# Altium schematic sheet 总图.SchDoc
size A3
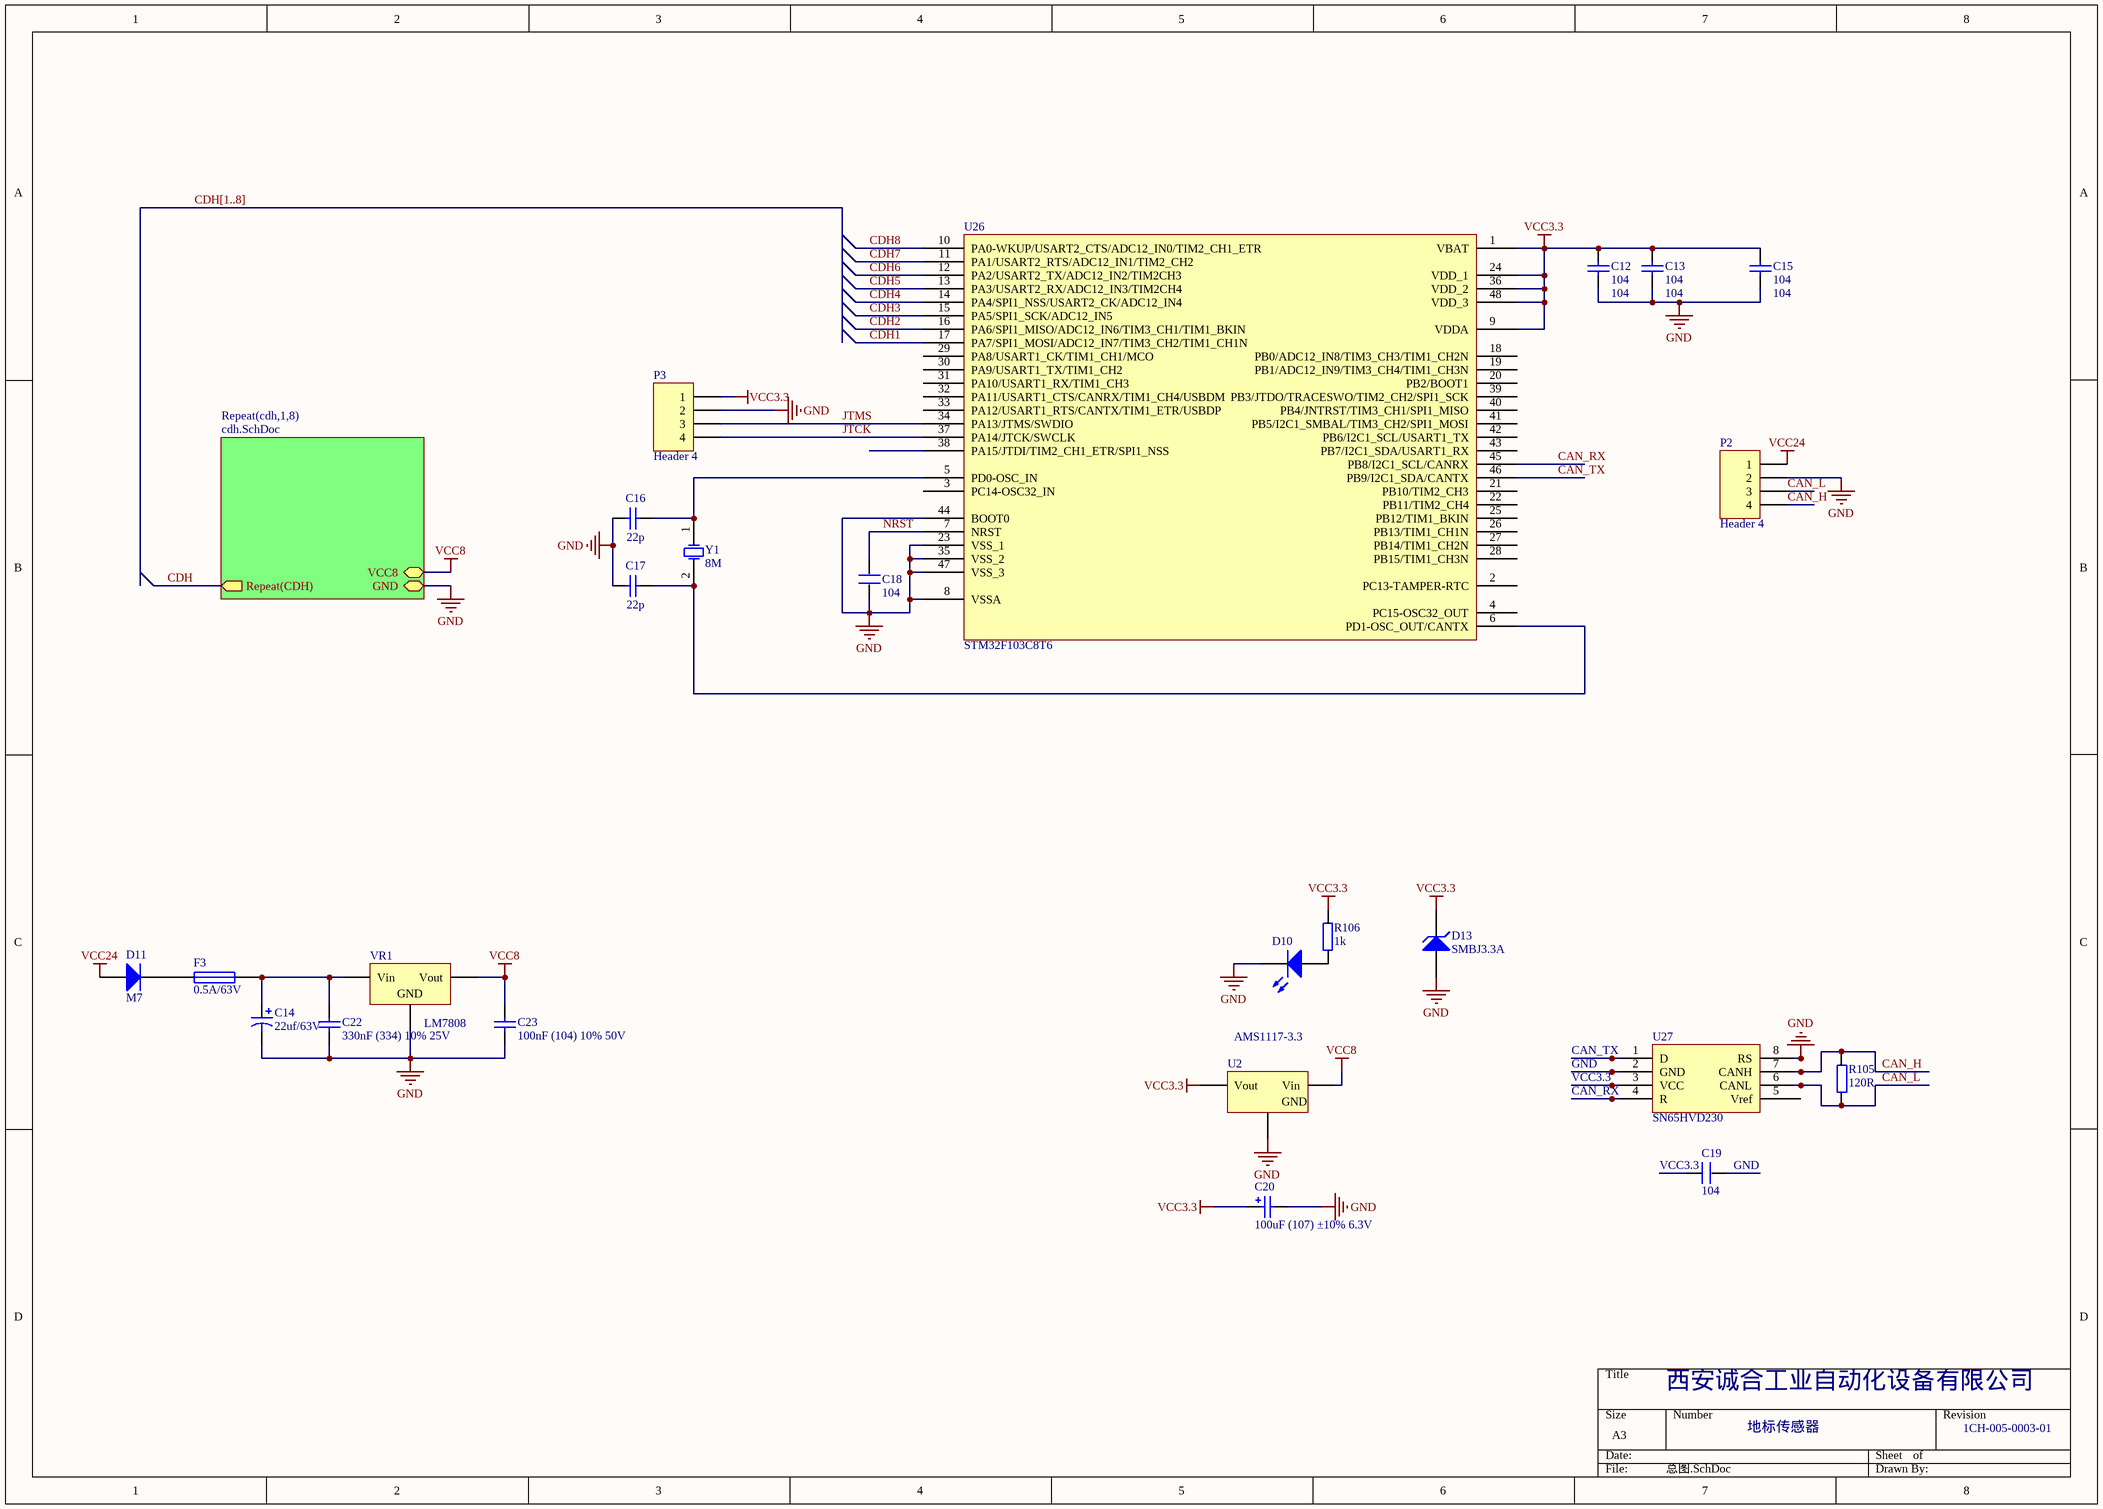
[diagram p0: 总图.SchDoc]

## Parts
C12  104  [0603-CAP]
C13  104  [0603-CAP]
C14  22uf/63V  [CAP-6*12]
C15  104  [0603-CAP]
C16  22p  [0603-CAP]
C17  22p  [0603-CAP]
C18  104  [0603-CAP]
C19  104  [0603-CAP]
C20  100uF (107) ±10% 6.3V  [CASE-B_3528]
C22  330nF (334) 10% 25V  [0603_C]
C23  100nF (104) 10% 50V  [0603_C]
D10  LED0  [LC-0805_LED_S1]  (value not drawn)
D11  M7  [SMA(DO-214AC)_S1]
D13  SMBJ3.3A  [SMB(DO-214AA)_S1]
F3  0.5A/63V  [1206]
P2  Header 4  [DZ-4-3.5]
P3  Header 4  [HDR1X4]
R105  120R  [0603]
R106  1k  [0603]
U2  AMS1117-3.3  [SOT-223]
U26  STM32F103C8T6  [LC-LQFP-48]
U27  SN65HVD230  [SOIC-8_150mil]
VR1  LM7808  [LC-TO-263-2]
Y1  8M  [XTAL_US1]

## Sub-sheets
Repeat(cdh,1,8) = cdh.SchDoc: GND (bidir), VCC8 (bidir), Repeat(CDH) (out)

## Nets
GND: C12.2 C13.2 C14.2 C15.2 C16.2 C17.2 C18.1 C19.2 C20.2 C22.1 C23.1 D10.K D13.1(A) P2.2 P3.2 U2.1(GND) U26.8(VSSA) U26.23(VSS_1) U26.35(VSS_2) U26.44(BOOT0) U26.47(VSS_3) U27.2(GND) U27.8(RS) VR1.2(GND) ; sheet Repeat(cdh,1,8)/GND
VCC3.3: C12.1 C13.1 C15.1 C19.1 C20.1 D13.2(K) P3.1 R106.1 U2.2(Vout) U26.1(VBAT) U26.9(VDDA) U26.24(VDD_1) U26.36(VDD_2) U26.48(VDD_3) U27.3(VCC)
VCC8: C23.2 U2.3(Vin) VR1.3(Vout) ; sheet Repeat(cdh,1,8)/VCC8
VCC24: D11.1(A) P2.1
CAN_H: P2.4 R105.2 U27.7(CANH)
CAN_L: P2.3 R105.1 U27.6(CANL)
CAN_RX: U26.45(PB8/I2C1_SCL/CANRX) U27.4(R)
CAN_TX: U26.46(PB9/I2C1_SDA/CANTX) U27.1(D)
CDH: sheet Repeat(cdh,1,8)/Repeat(CDH)
CDH1: U26.17(PA7/SPI1_MOSI/ADC12_IN7/TIM3_CH2/TIM1_CH1N)
CDH2: U26.16(PA6/SPI1_MISO/ADC12_IN6/TIM3_CH1/TIM1_BKIN)
CDH3: U26.15(PA5/SPI1_SCK/ADC12_IN5)
CDH4: U26.14(PA4/SPI1_NSS/USART2_CK/ADC12_IN4)
CDH5: U26.13(PA3/USART2_RX/ADC12_IN3/TIM2CH4)
CDH6: U26.12(PA2/USART2_TX/ADC12_IN2/TIM2CH3)
CDH7: U26.11(PA1/USART2_RTS/ADC12_IN1/TIM2_CH2)
CDH8: U26.10(PA0-WKUP/USART2_CTS/ADC12_IN0/TIM2_CH1_ETR)
JTCK: P3.4 U26.37(PA14/JTCK/SWCLK)
JTMS: P3.3 U26.34(PA13/JTMS/SWDIO)
NRST: C18.2 U26.7(NRST)
NetC14_1: C14.1 C22.2 F3.2 VR1.1(Vin)
NetC16_1: C16.1 U26.5(PD0-OSC_IN) Y1.1(OSC1)
NetC17_1: C17.1 U26.6(PD1-OSC_OUT/CANTX) Y1.2(OSC2)
NetD10_A: D10.A R106.2
NetD11_2: D11.2(K) F3.1

Not connected (* = marked no-connect by the designer): U26 2(PC13-TAMPER-RTC) 3(PC14-OSC32_IN) 4(PC15-OSC32_OUT) 18(PB0/ADC12_IN8/TIM3_CH3/TIM1_CH2N) 19(PB1/ADC12_IN9/TIM3_CH4/TIM1_CH3N) 20(PB2/BOOT1) 21(PB10/TIM2_CH3) 22(PB11/TIM2_CH4) 25(PB12/TIM1_BKIN) 26(PB13/TIM1_CH1N) 27(PB14/TIM1_CH2N) 28(PB15/TIM1_CH3N) 29(PA8/USART1_CK/TIM1_CH1/MCO) 30(PA9/USART1_TX/TIM1_CH2) 31(PA10/USART1_RX/TIM1_CH3) 32(PA11/USART1_CTS/CANRX/TIM1_CH4/USBDM) 33(PA12/USART1_RTS/CANTX/TIM1_ETR/USBDP) 38(PA15/JTDI/TIM2_CH1_ETR/SPI1_NSS) 39(PB3/JTDO/TRACESWO/TIM2_CH2/SPI1_SCK) 40(PB4/JNTRST/TIM3_CH1/SPI1_MISO) 41(PB5/I2C1_SMBAL/TIM3_CH2/SPI1_MOSI) 42(PB6/I2C1_SCL/USART1_TX) 43(PB7/I2C1_SDA/USART1_RX); U27 5(Vref)

## Buses and harness runs
bus CDH[1..8]

## Notes on the sheet
- 西安诚合工业自动化设备有限公司
- 地标传感器
- 1CH-005-0003-01

## Library data of the parts
C12 C13 C15-C17 = Cap: Capacitor; Published: 8-Jun-2000; LatestRevisionDate: 17-Jul-2002; LatestRevisionNote: Re-released for DXP Platform.; PackageReference: RAD-0.3; Publisher: Altium Limited; PackageDescription: Radial Cap, Thru-Hole; 2 Leads; 0.3 in Pin Spacing
  C12 C13 C15: Value: 104
  C16 C17: Value: 22p
C14 = Cap Pol3: Polarized Capacitor (Surface Mount); Value: 100pF; Published: 8-Jun-2000; LatestRevisionDate: 29-May-2009; LatestRevisionNote: IPC-7351 Footprint Added.; PackageReference: C0805; Publisher: Altium Limited; PackageDescription: Chip Capacitor
C18 = C
C19 = C_3
C20 = 3528 100uF (107) 10% 6.3V: 钽电容; ComponentLink1Description: 供应商链接; ComponentLink1URL: http://www.szlcsc.com/product/details_16815.html; Package: 3528; Supplier: LC; SuppliersPartNumber: C16133
C22 = 0603 330nF (334) 10% 25V: 贴片电容; ComponentLink1Description: 供应商链接; ComponentLink1URL: http://www.szlcsc.com/product/details_1967.html; Package: 0603; Supplier: LC; SuppliersPartNumber: C1615
C23 = 0603 100nF (104) 10% 50V: 贴片电容; ComponentLink1Description: 供应商链接; ComponentLink1URL: http://www.szlcsc.com/product/details_15331.html; Package: 0603; Supplier: LC; SuppliersPartNumber: C14663
D10 = LED0: Typical INFRARED GaAs LED; Published: 8-Jun-2000; LatestRevisionDate: 08-Jul-2005; LatestRevisionNote: Mech Layer 1 removed.; PackageReference: LED-0; Publisher: Altium Limited; PackageDescription: LED; 2 Leads
D11 = SMA(DO-214AC) M7: 二极管; 备注: 1N4007 4007 编号C2464 已经停售, 使用新物料编号C95872; ComponentLink1Description: 供应商链接; ComponentLink1URL: http://www.szlcsc.com/product/details_2841.html; Package: SMA(DO-214AC); Supplier: LC; SuppliersPartNumber: C95872
D13 = D Zener: Zener Diode; Published: 8-Jun-2000; LatestRevisionDate: 17-Jul-2002; LatestRevisionNote: Re-released for DXP Platform.; PackageReference: DIODE-0.7; Publisher: Altium Limited; PackageDescription: Diode, Thru-Hole; 2 Leads; 0.7 in Pin Spacing
F3 = Fuse 1: Fuse; Published: 8-Jun-2000; LatestRevisionDate: 17-Jul-2002; LatestRevisionNote: Re-released for DXP Platform.; PackageReference: PIN-W2/E2.8; Publisher: Altium Limited; PackageDescription: Thru-Hole; 2 Leads
P2 P3 = Header 4: Header, 4-Pin; LatestRevisionDate: 17-Jul-2002; LatestRevisionNote: Re-released for DXP Platform.; Publisher: Altium Limited
R105 R106 = R_2
U2 = SOT-223 AMS1117-3.3: 低压差线性稳压(LDO); ComponentLink1Description: 供应商链接; ComponentLink1URL: http://www.szlcsc.com/product/details_6652.html; Package: SOT-223; Supplier: LC; SuppliersPartNumber: C6186
U26 = stm32f103v8t6
U27 = CAN/SN65HVD230DR: CAN; ComponentLink1Description: 供应商链接; ComponentLink1URL: http://www.szlcsc.com/product/details_12661.html; Package: SOIC-8_150mil; Supplier: LC; SuppliersPartNumber: C12084
VR1 = SOT-89 78L05G-AB3-R: 低压差线性稳压(LDO); ComponentLink1Description: 供应商链接; ComponentLink1URL: http://www.szlcsc.com/product/details_72235.html; Package: SOT-89; Supplier: LC; SuppliersPartNumber: C71136
Y1 = XTAL: Crystal Oscillator; Published: 8-Jun-2000; LatestRevisionDate: 17-Jul-2002; LatestRevisionNote: Re-released for DXP Platform.; PackageReference: R38; Publisher: Altium Limited; PackageDescription: Crystal, Thru-Hole; 2 Leads; Body 3.1 x 8.2 mm (Dia.xH)